# Altium schematic sheet EEPROM_SCH.SchDoc
size D
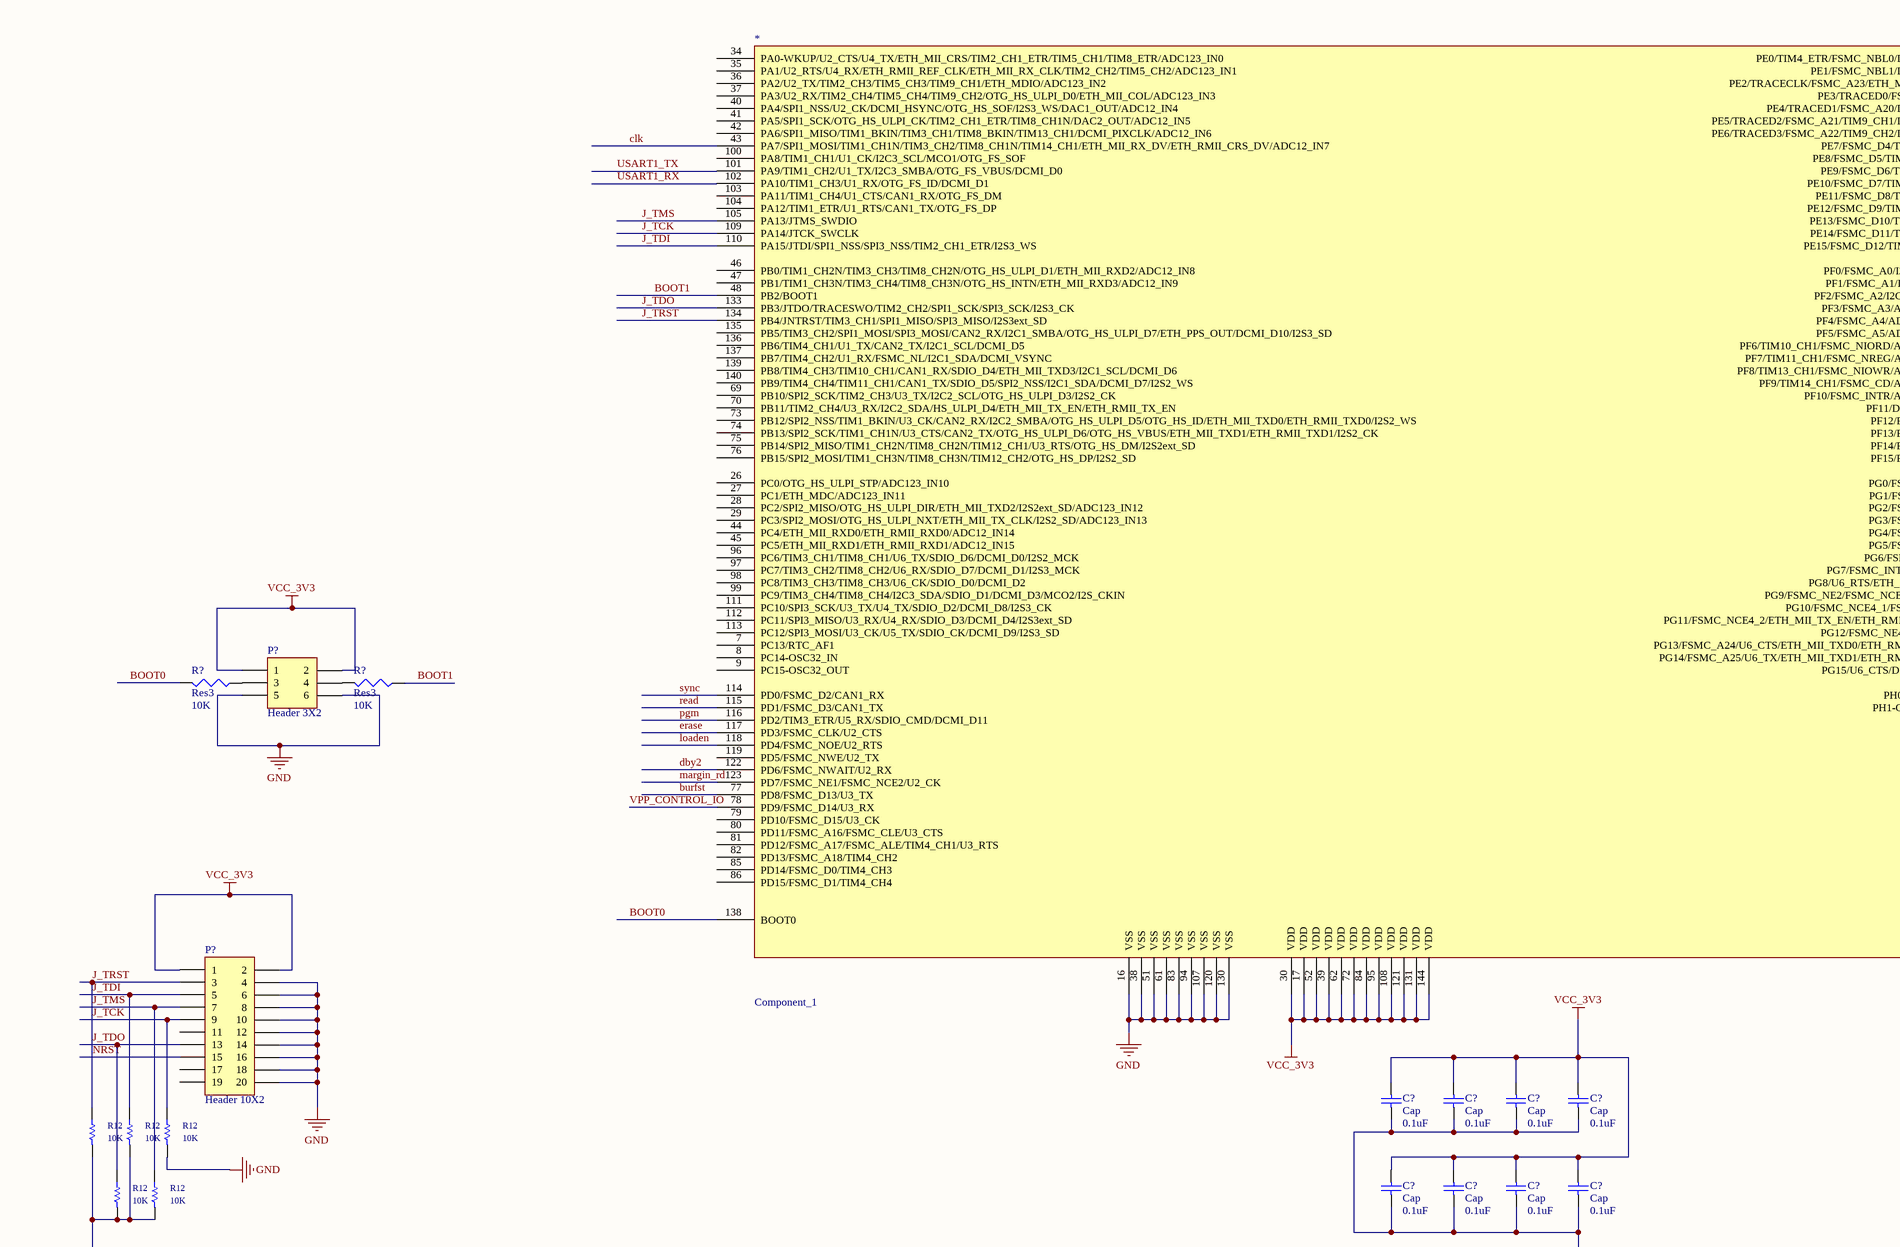
[diagram p0: EEPROM_SCH.SchDoc, top left]
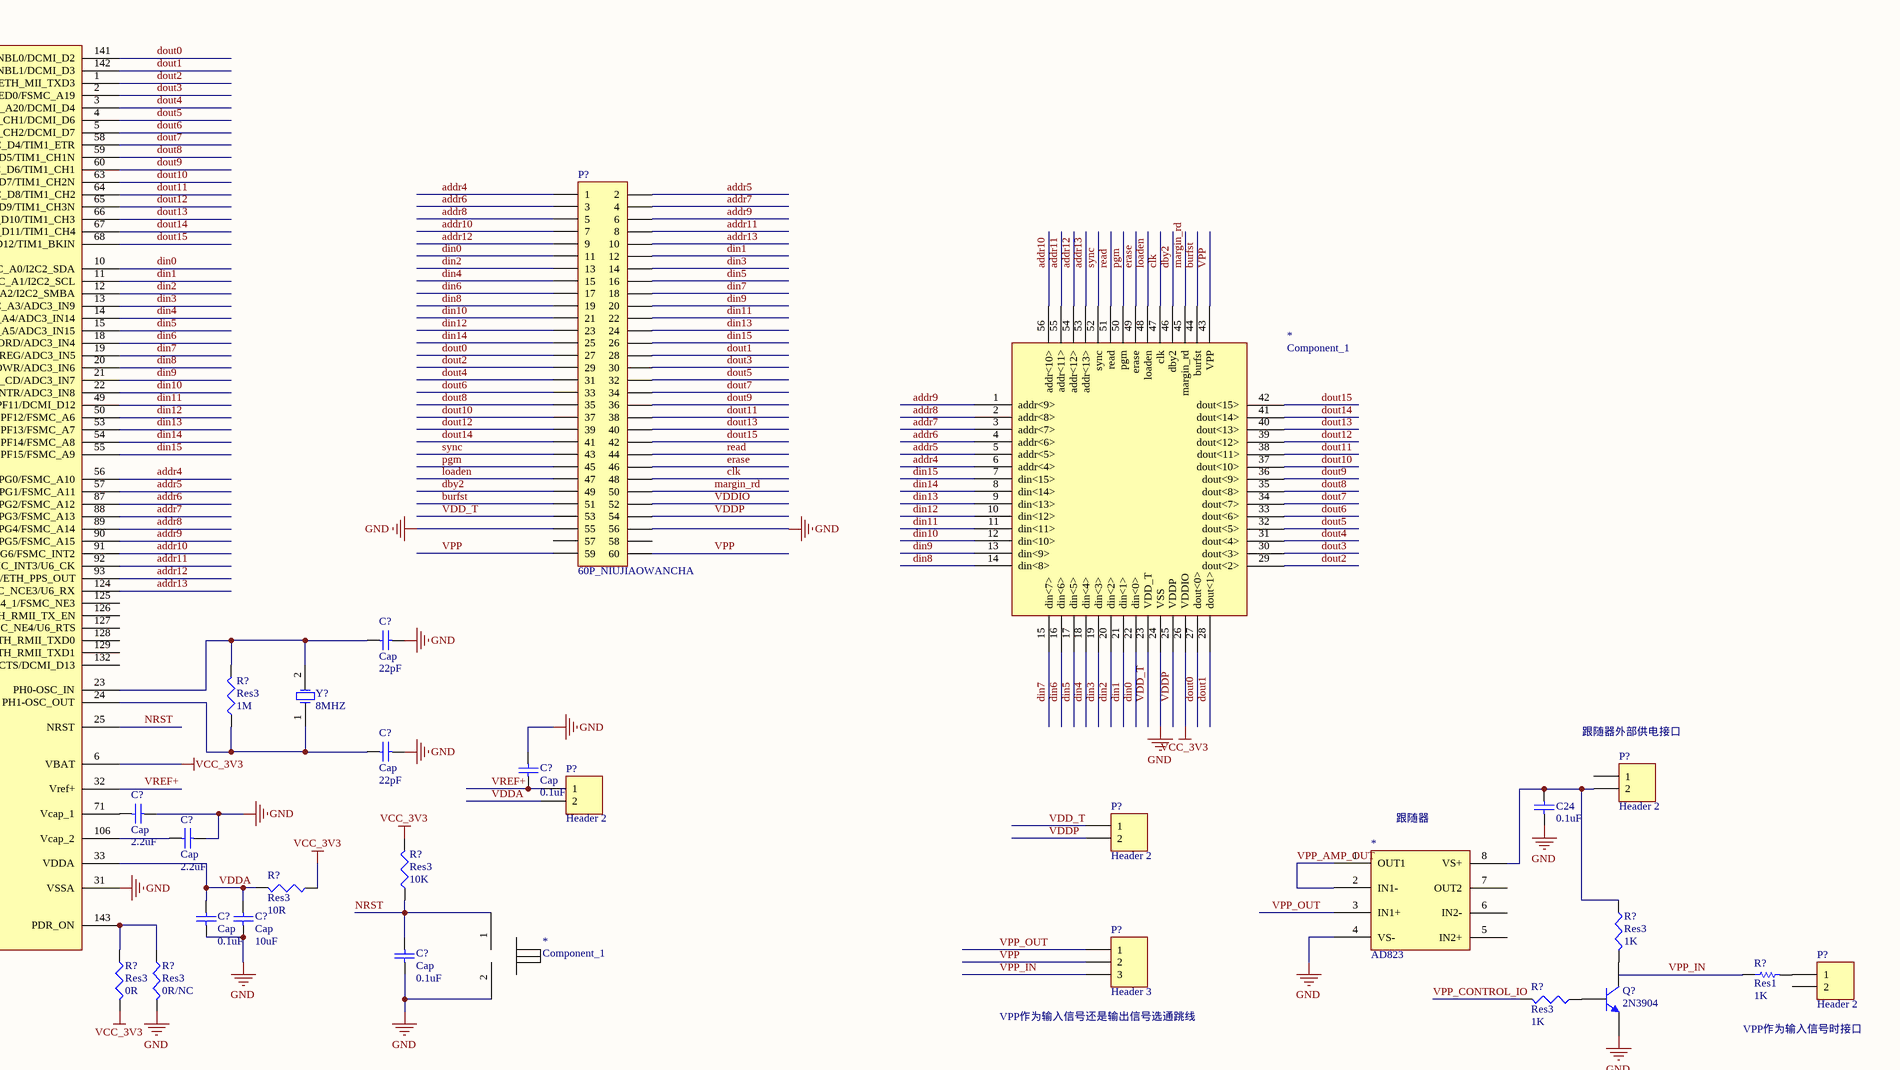
[diagram p1: EEPROM_SCH.SchDoc, top right]
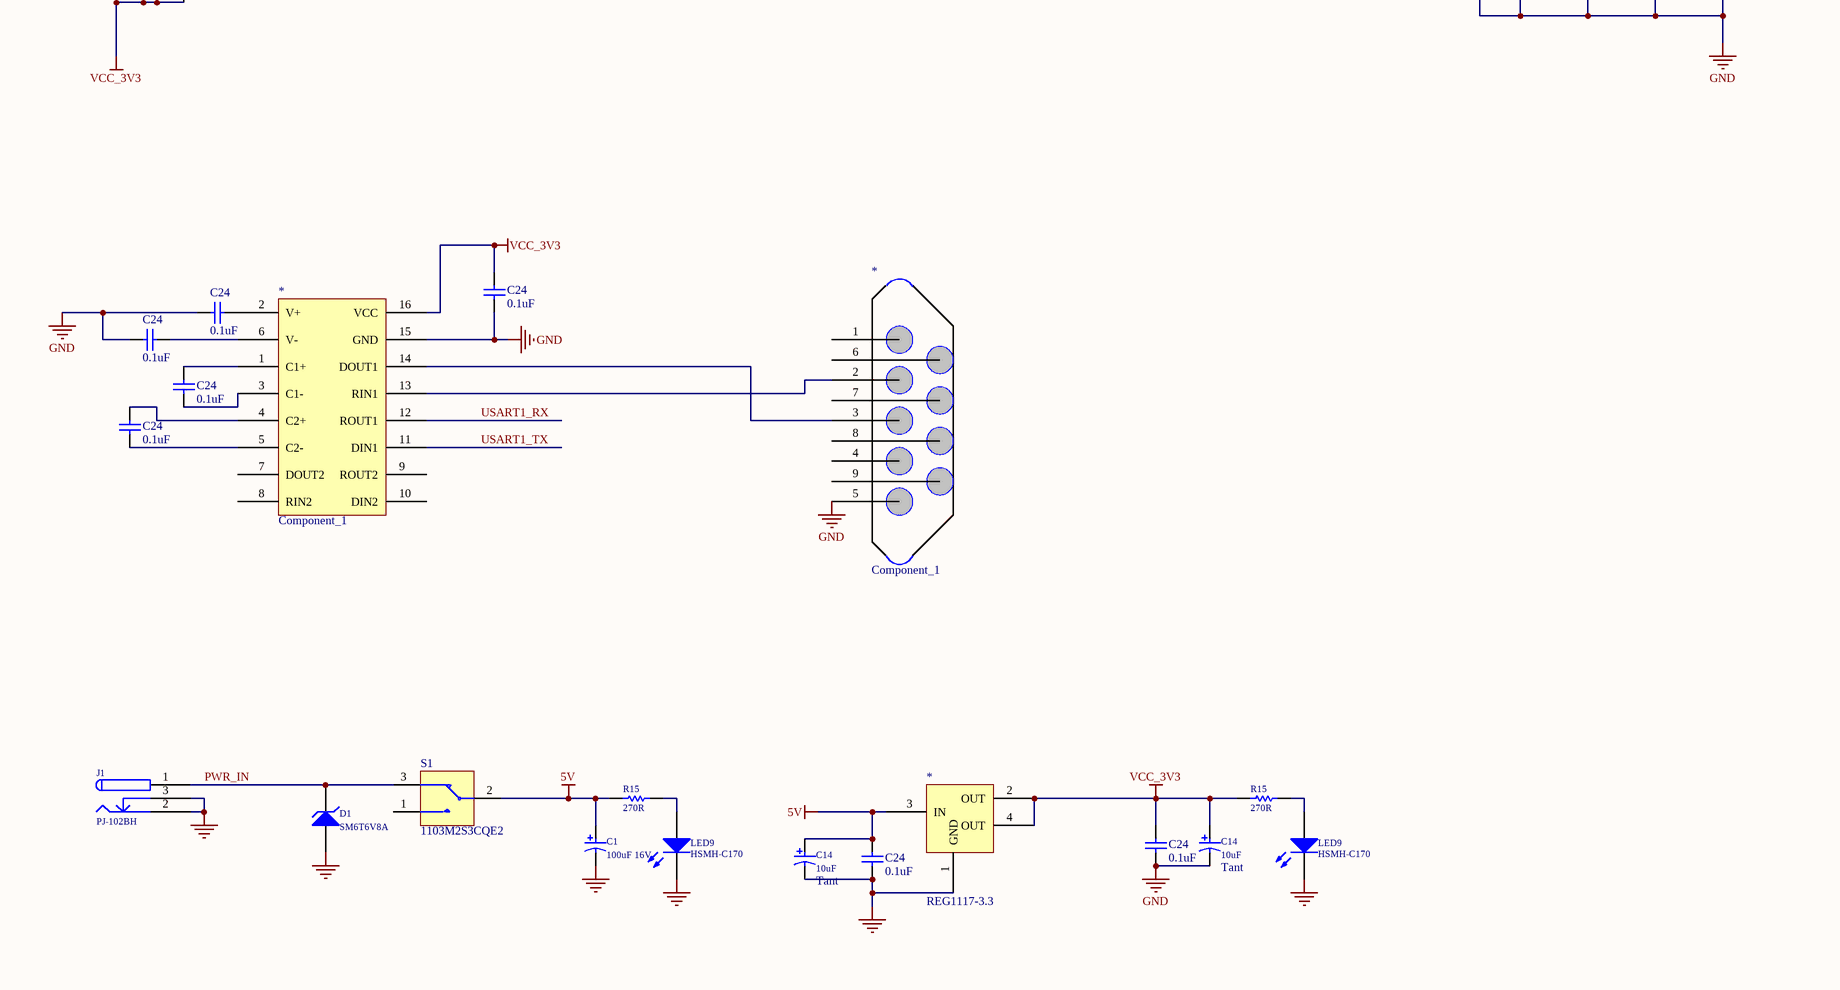
[diagram p2: EEPROM_SCH.SchDoc, bottom left]
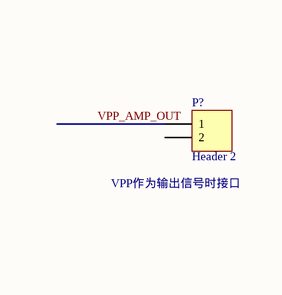
[diagram p3: EEPROM_SCH.SchDoc, bottom right]

## Parts
(Parts that share a designator on the sheet are numbered #1, #2 ... from top to bottom, then left to right.)
*#1  Component_1  [STM32F407ZGT6_LCC144]
*#2  Component_1
*#3  AD823
*#4  Component_1
*#5  Component_1
*#6  Component_1
*#7  REG1117-3.3  [PCBComponent_1]
C1  100uF 16V  [CAPPR2-5X6.8]
C14#1  10uF  Capacitor Type: Tant  [MCCT-B]
C14#2  10uF  Capacitor Type: Tant  [MCCT-B]
C24#1  0.1uF  [CC2012-0805]
C24#2  0.1uF  [CC2012-0805]
C24#3  0.1uF  [CC2012-0805]
C24#4  0.1uF  [CC2012-0805]
C24#5  0.1uF  [CC2012-0805]
C24#6  0.1uF  [CC2012-0805]
C24#7  0.1uF  [CC2012-0805]
C24#8  0.1uF  [CC2012-0805]
C?#1  Cap  value 22pF  [RAD-0.3]
C?#2  Cap  value 22pF  [RAD-0.3]
C?#3  Cap  value 0.1uF  [RAD-0.3]
C?#4  Cap  value 2.2uF  [RAD-0.3]
C?#5  Cap  value 2.2uF  [RAD-0.3]
C?#6  Cap  value 0.1uF  [RAD-0.3]
C?#7  Cap  value 10uF  [RAD-0.3]
C?#8  Cap  value 0.1uF  [RAD-0.3]
C?#9  Cap  value 0.1uF  [RAD-0.3]
C?#10  Cap  value 0.1uF  [RAD-0.3]
C?#11  Cap  value 0.1uF  [RAD-0.3]
C?#12  Cap  value 0.1uF  [RAD-0.3]
C?#13  Cap  value 0.1uF  [RAD-0.3]
C?#14  Cap  value 0.1uF  [RAD-0.3]
C?#15  Cap  value 0.1uF  [RAD-0.3]
C?#16  Cap  value 0.1uF  [RAD-0.3]
D1  SM6T6V8A  [PCBComponent_1]
J1  PJ-102BH  [PCBComponent_1]
LED9#1  HSMH-C170  [SMD _LED]
LED9#2  HSMH-C170  [SMD _LED]
P?#1  60P_NIUJIAOWANCHA  [PCBComponent_1]
P?#2  Header 3X2  [PCBComponent_1]
P?#3  Header 2  [HDR1X2]
P?#4  Header 2  [HDR1X2]
P?#5  Header 2  [HDR1X2]
P?#6  Header 3  [HDR1X3]
P?#7  Header 10X2  [HDR2X10]
P?#8  Header 2  [HDR1X2]
P?#9  Header 2  [HDR1X2]
Q?  2N3904  [TO-92A]
R12#1  10K  [CC2012-0805]
R12#2  10K  [CC2012-0805]
R12#3  10K  [CC2012-0805]
R12#4  10K  [CC2012-0805]
R12#5  10K  [CC2012-0805]
R15#1  270R  [CR2012-0805]
R15#2  270R  [CR2012-0805]
R?#1  Res3  value 10K  [J1-0603]
R?#2  Res3  value 10K  [J1-0603]
R?#3  Res3  value 1M  [J1-0603]
R?#4  Res3  value 10K  [J1-0603]
R?#5  Res3  value 10R  [J1-0603]
R?#6  Res3  value 1K  [J1-0603]
R?#7  Res3  value 0R  [J1-0603]
R?#8  Res3  value 0R/NC  [J1-0603]
R?#9  Res1  value 1K  [AXIAL-0.3]
R?#10  Res3  value 1K  [J1-0603]
S1  1103M2S3CQE2  [PCBComponent_1]
Y?  8MHZ  [R38]

## Nets
5V: *#7.3(IN) C1.1 C14#2.1 C24#8.2 R15#1.2 S1.2
GND: *#1.16(VSS) *#1.31(VSSA) *#1.38(VSS) *#1.51(VSS) *#1.61(VSS) *#1.83(VSS) *#1.94(VSS) *#1.107(VSS) *#1.120(VSS) *#1.130(VSS) *#2.24(VSS) *#3.4(VS-) *#4.2 *#5.15(GND) *#6.5 *#7.1(GND) C1.2 C14#1.2 C14#2.2 C24#1.1 C24#2.1 C24#3.1 C24#4.2 C24#7.1 C24#8.1 C?#1.1 C?#2.1 C?#3.1 C?#4.2 C?#5.2 C?#6.2 C?#7.2 C?#8.2 C?#9.1 C?#10.1 C?#11.1 C?#12.1 C?#13.1 C?#14.1 C?#15.1 C?#16.1 D1.1(A) J1.2 J1.3 LED9#1.2(K) LED9#2.2(K) P?#1.55 P?#1.56 P?#2.5 P?#2.6 P?#7.4 P?#7.6 P?#7.8 P?#7.10 P?#7.12 P?#7.14 P?#7.16 P?#7.18 P?#7.20 Q?.1(E) R12#3.2 R?#8.2
VCC_3V3: *#1.6(VBAT) *#1.17(VDD) *#1.30(VDD) *#1.39(VDD) *#1.52(VDD) *#1.62(VDD) *#1.72(VDD) *#1.84(VDD) *#1.95(VDD) *#1.108(VDD) *#1.121(VDD) *#1.131(VDD) *#1.144(VDD) *#2.26(VDDIO) *#5.16(VCC) *#7.2(OUT) *#7.4(OUT) C14#1.1 C24#3.2 C24#7.2 C?#9.2 C?#10.2 C?#11.2 C?#12.2 C?#13.2 C?#14.2 C?#15.2 C?#16.2 P?#2.1 P?#2.2 P?#7.1 P?#7.2 R12#1.2 R12#2.2 R12#4.2 R12#5.2 R15#2.2 R?#4.2 R?#5.1 R?#7.2
addr4: *#1.56(PG0/FSMC_A10) *#2.6(addr<4>) P?#1.1
addr5: *#1.57(PG1/FSMC_A11) *#2.5(addr<5>) P?#1.2
addr6: *#1.87(PG2/FSMC_A12) *#2.4(addr<6>) P?#1.3
addr7: *#1.88(PG3/FSMC_A13) *#2.3(addr<7>) P?#1.4
addr8: *#1.89(PG4/FSMC_A14) *#2.2(addr<8>) P?#1.5
addr9: *#1.90(PG5/FSMC_A15) *#2.1(addr<9>) P?#1.6
addr10: *#1.91(PG6/FSMC_INT2) *#2.56(addr<10>) P?#1.7
addr11: *#1.92(PG7/FSMC_INT3/U6_CK) *#2.55(addr<11>) P?#1.8
addr12: *#1.93(PG8/U6_RTS/ETH_PPS_OUT) *#2.54(addr<12>) P?#1.9
addr13: *#1.124(PG9/FSMC_NE2/FSMC_NCE3/U6_RX) *#2.53(addr<13>) P?#1.10
BOOT0: *#1.138(BOOT0) R?#1.2
BOOT1: *#1.48(PB2/BOOT1) R?#2.1
burfst: *#1.77(PD8/FSMC_D13/U3_TX) *#2.44(burfst) P?#1.51
clk: *#1.43(PA7/SPI1_MOSI/TIM1_CH1N/TIM3_CH2/TIM8_CH1N/TIM14_CH1/ETH_MII_RX_DV/ETH_RMII_CRS_DV/ADC12_IN7) *#2.47(clk) P?#1.48
dby2: *#1.122(PD6/FSMC_NWAIT/U2_RX) *#2.46(dby2) P?#1.49
din0: *#1.10(PF0/FSMC_A0/I2C2_SDA) *#2.22(din<0>) P?#1.11
din1: *#1.11(PF1/FSMC_A1/I2C2_SCL) *#2.21(din<1>) P?#1.12
din2: *#1.12(PF2/FSMC_A2/I2C2_SMBA) *#2.20(din<2>) P?#1.13
din3: *#1.13(PF3/FSMC_A3/ADC3_IN9) *#2.19(din<3>) P?#1.14
din4: *#1.14(PF4/FSMC_A4/ADC3_IN14) *#2.18(din<4>) P?#1.15
din5: *#1.15(PF5/FSMC_A5/ADC3_IN15) *#2.17(din<5>) P?#1.16
din6: *#1.18(PF6/TIM10_CH1/FSMC_NIORD/ADC3_IN4) *#2.16(din<6>) P?#1.17
din7: *#1.19(PF7/TIM11_CH1/FSMC_NREG/ADC3_IN5) *#2.15(din<7>) P?#1.18
din8: *#1.20(PF8/TIM13_CH1/FSMC_NIOWR/ADC3_IN6) *#2.14(din<8>) P?#1.19
din9: *#1.21(PF9/TIM14_CH1/FSMC_CD/ADC3_IN7) *#2.13(din<9>) P?#1.20
din10: *#1.22(PF10/FSMC_INTR/ADC3_IN8) *#2.12(din<10>) P?#1.21
din11: *#1.49(PF11/DCMI_D12) *#2.11(din<11>) P?#1.22
din12: *#1.50(PF12/FSMC_A6) *#2.10(din<12>) P?#1.23
din13: *#1.53(PF13/FSMC_A7) *#2.9(din<13>) P?#1.24
din14: *#1.54(PF14/FSMC_A8) *#2.8(din<14>) P?#1.25
din15: *#1.55(PF15/FSMC_A9) *#2.7(din<15>) P?#1.26
dout0: *#1.141(PE0/TIM4_ETR/FSMC_NBL0/DCMI_D2) *#2.27(dout<0>) P?#1.27
dout1: *#1.142(PE1/FSMC_NBL1/DCMI_D3) *#2.28(dout<1>) P?#1.28
dout2: *#1.1(PE2/TRACECLK/FSMC_A23/ETH_MII_TXD3) *#2.29(dout<2>) P?#1.29
dout3: *#1.2(PE3/TRACED0/FSMC_A19) *#2.30(dout<3>) P?#1.30
dout4: *#1.3(PE4/TRACED1/FSMC_A20/DCMI_D4) *#2.31(dout<4>) P?#1.31
dout5: *#1.4(PE5/TRACED2/FSMC_A21/TIM9_CH1/DCMI_D6) *#2.32(dout<5>) P?#1.32
dout6: *#1.5(PE6/TRACED3/FSMC_A22/TIM9_CH2/DCMI_D7) *#2.33(dout<6>) P?#1.33
dout7: *#1.58(PE7/FSMC_D4/TIM1_ETR) *#2.34(dout<7>) P?#1.34
dout8: *#1.59(PE8/FSMC_D5/TIM1_CH1N) *#2.35(dout<8>) P?#1.35
dout9: *#1.60(PE9/FSMC_D6/TIM1_CH1) *#2.36(dout<9>) P?#1.36
dout10: *#1.63(PE10/FSMC_D7/TIM1_CH2N) *#2.37(dout<10>) P?#1.37
dout11: *#1.64(PE11/FSMC_D8/TIM1_CH2) *#2.38(dout<11>) P?#1.38
dout12: *#1.65(PE12/FSMC_D9/TIM1_CH3N) *#2.39(dout<12>) P?#1.39
dout13: *#1.66(PE13/FSMC_D10/TIM1_CH3) *#2.40(dout<13>) P?#1.40
dout14: *#1.67(PE14/FSMC_D11/TIM1_CH4) *#2.41(dout<14>) P?#1.41
dout15: *#1.68(PE15/FSMC_D12/TIM1_BKIN) *#2.42(dout<15>) P?#1.42
erase: *#1.117(PD3/FSMC_CLK/U2_CTS) *#2.49(erase) P?#1.46
J_TCK: *#1.25(NRST) *#1.105(PA13/JTMS_SWDIO) *#1.109(PA14/JTCK_SWCLK) *#1.110(PA15/JTDI/SPI1_NSS/SPI3_NSS/TIM2_CH1_ETR/I2S3_WS) *#1.133(PB3/JTDO/TRACESWO/TIM2_CH2/SPI1_SCK/SPI3_SCK/I2S3_CK) *#1.134(PB4/JNTRST/TIM3_CH1/SPI1_MISO/SPI3_MISO/I2S3ext_SD) *#4.1 C?#8.1 P?#7.3 P?#7.5 P?#7.7 P?#7.9 P?#7.13 P?#7.15 R12#1.1 R12#2.1 R12#3.1 R12#4.1 R12#5.1 R?#4.1  [also labelled J_TDI, J_TDO, J_TMS, J_TRST, NRST]
loaden: *#1.118(PD4/FSMC_NOE/U2_RTS) *#2.48(loaden) P?#1.47
margin_rd: *#1.123(PD7/FSMC_NE1/FSMC_NCE2/U2_CK) *#2.45(margin_rd) P?#1.50
pgm: *#1.116(PD2/TIM3_ETR/U5_RX/SDIO_CMD/DCMI_D11) *#2.50(pgm) P?#1.45
PWR_IN: D1.2(K) J1.1 S1.3
read: *#1.115(PD1/FSMC_D3/CAN1_TX) *#2.51(read) P?#1.44
sync: *#1.114(PD0/FSMC_D2/CAN1_RX) *#2.52(sync) P?#1.43
USART1_RX: *#1.102(PA10/TIM1_CH3/U1_RX/OTG_FS_ID/DCMI_D1) *#5.12(ROUT1)
USART1_TX: *#1.101(PA9/TIM1_CH2/U1_TX/I2C3_SMBA/OTG_FS_VBUS/DCMI_D0) *#5.11(DIN1)
VDD_T: *#2.23(VDD_T) P?#1.53 P?#5.1
VDDA: *#1.33(VDDA) C?#6.1 C?#7.1 P?#4.2 R?#5.2
VDDIO: P?#1.52
VDDP: *#2.25(VDDP) P?#1.54 P?#5.2
VPP: *#2.43(VPP) P?#1.59 P?#1.60 P?#6.2
VPP_AMP_OUT: *#3.1(OUT1) *#3.2(IN1-) P?#9.1
VPP_CONTROL_IO: *#1.78(PD9/FSMC_D14/U3_RX) R?#10.2
VPP_IN: P?#6.3 R?#9.1
VPP_OUT: *#3.3(IN1+) P?#6.1
VREF+: *#1.32(Vref+) C?#3.2 P?#4.1
Net*#1_23: *#1.23(PH0-OSC_IN) C?#1.2 R?#3.2 Y?.2(OSC2)
Net*#1_24: *#1.24(PH1-OSC_OUT) C?#2.2 R?#3.1 Y?.1(OSC1)
Net*#1_71: *#1.71(Vcap_1) C?#4.1
Net*#1_106: *#1.106(Vcap_2) C?#5.1
Net*#1_143: *#1.143(PDR_ON) R?#7.1 R?#8.1
Net*#3_8: *#3.8(VS+) C24#1.2 P?#3.2 R?#6.1
Net*#5_1: *#5.1(C1+) C24#5.2
Net*#5_2: *#5.2(V+) C24#2.2
Net*#5_3: *#5.3(C1-) C24#5.1
Net*#5_4: *#5.4(C2+) C24#6.2
Net*#5_5: *#5.5(C2-) C24#6.1
Net*#5_6: *#5.6(V-) C24#4.1
Net*#5_13: *#5.13(RIN1) *#6.2
Net*#5_14: *#5.14(DOUT1) *#6.3
NetLED9#1_1: LED9#1.1(A) R15#1.1
NetLED9#2_1: LED9#2.1(A) R15#2.1
NetP?#2_3: P?#2.3 R?#1.1
NetP?#2_4: P?#2.4 R?#2.2
NetP?#8_1: P?#8.1 R?#9.2
NetQ?_2: Q?.2(B) R?#10.1
NetQ?_3: Q?.3(C) R?#6.2

Not connected (* = marked no-connect by the designer): *#1 7(PC13/RTC_AF1) 8(PC14-OSC32_IN) 9(PC15-OSC32_OUT) 26(PC0/OTG_HS_ULPI_STP/ADC123_IN10) 27(PC1/ETH_MDC/ADC123_IN11) 28(PC2/SPI2_MISO/OTG_HS_ULPI_DIR/ETH_MII_TXD2/I2S2ext_SD/ADC123_IN12) 29(PC3/SPI2_MOSI/OTG_HS_ULPI_NXT/ETH_MII_TX_CLK/I2S2_SD/ADC123_IN13) 34(PA0-WKUP/U2_CTS/U4_TX/ETH_MII_CRS/TIM2_CH1_ETR/TIM5_CH1/TIM8_ETR/ADC123_IN0) 35(PA1/U2_RTS/U4_RX/ETH_RMII_REF_CLK/ETH_MII_RX_CLK/TIM2_CH2/TIM5_CH2/ADC123_IN1) 36(PA2/U2_TX/TIM2_CH3/TIM5_CH3/TIM9_CH1/ETH_MDIO/ADC123_IN2) 37(PA3/U2_RX/TIM2_CH4/TIM5_CH4/TIM9_CH2/OTG_HS_ULPI_D0/ETH_MII_COL/ADC123_IN3) 40(PA4/SPI1_NSS/U2_CK/DCMI_HSYNC/OTG_HS_SOF/I2S3_WS/DAC1_OUT/ADC12_IN4) 41(PA5/SPI1_SCK/OTG_HS_ULPI_CK/TIM2_CH1_ETR/TIM8_CH1N/DAC2_OUT/ADC12_IN5) 42(PA6/SPI1_MISO/TIM1_BKIN/TIM3_CH1/TIM8_BKIN/TIM13_CH1/DCMI_PIXCLK/ADC12_IN6) 44(PC4/ETH_MII_RXD0/ETH_RMII_RXD0/ADC12_IN14) 45(PC5/ETH_MII_RXD1/ETH_RMII_RXD1/ADC12_IN15) 46(PB0/TIM1_CH2N/TIM3_CH3/TIM8_CH2N/OTG_HS_ULPI_D1/ETH_MII_RXD2/ADC12_IN8) 47(PB1/TIM1_CH3N/TIM3_CH4/TIM8_CH3N/OTG_HS_INTN/ETH_MII_RXD3/ADC12_IN9) 69(PB10/SPI2_SCK/TIM2_CH3/U3_TX/I2C2_SCL/OTG_HS_ULPI_D3/I2S2_CK) 70(PB11/TIM2_CH4/U3_RX/I2C2_SDA/HS_ULPI_D4/ETH_MII_TX_EN/ETH_RMII_TX_EN) 73(PB12/SPI2_NSS/TIM1_BKIN/U3_CK/CAN2_RX/I2C2_SMBA/OTG_HS_ULPI_D5/OTG_HS_ID/ETH_MII_TXD0/ETH_RMII_TXD0/I2S2_WS) 74(PB13/SPI2_SCK/TIM1_CH1N/U3_CTS/CAN2_TX/OTG_HS_ULPI_D6/OTG_HS_VBUS/ETH_MII_TXD1/ETH_RMII_TXD1/I2S2_CK) 75(PB14/SPI2_MISO/TIM1_CH2N/TIM8_CH2N/TIM12_CH1/U3_RTS/OTG_HS_DM/I2S2ext_SD) 76(PB15/SPI2_MOSI/TIM1_CH3N/TIM8_CH3N/TIM12_CH2/OTG_HS_DP/I2S2_SD) 79(PD10/FSMC_D15/U3_CK) 80(PD11/FSMC_A16/FSMC_CLE/U3_CTS) 81(PD12/FSMC_A17/FSMC_ALE/TIM4_CH1/U3_RTS) 82(PD13/FSMC_A18/TIM4_CH2) 85(PD14/FSMC_D0/TIM4_CH3) 86(PD15/FSMC_D1/TIM4_CH4) 96(PC6/TIM3_CH1/TIM8_CH1/U6_TX/SDIO_D6/DCMI_D0/I2S2_MCK) 97(PC7/TIM3_CH2/TIM8_CH2/U6_RX/SDIO_D7/DCMI_D1/I2S3_MCK) 98(PC8/TIM3_CH3/TIM8_CH3/U6_CK/SDIO_D0/DCMI_D2) 99(PC9/TIM3_CH4/TIM8_CH4/I2C3_SDA/SDIO_D1/DCMI_D3/MCO2/I2S_CKIN) 100(PA8/TIM1_CH1/U1_CK/I2C3_SCL/MCO1/OTG_FS_SOF) 103(PA11/TIM1_CH4/U1_CTS/CAN1_RX/OTG_FS_DM) 104(PA12/TIM1_ETR/U1_RTS/CAN1_TX/OTG_FS_DP) 111(PC10/SPI3_SCK/U3_TX/U4_TX/SDIO_D2/DCMI_D8/I2S3_CK) 112(PC11/SPI3_MISO/U3_RX/U4_RX/SDIO_D3/DCMI_D4/I2S3ext_SD) 113(PC12/SPI3_MOSI/U3_CK/U5_TX/SDIO_CK/DCMI_D9/I2S3_SD) 119(PD5/FSMC_NWE/U2_TX) 125(PG10/FSMC_NCE4_1/FSMC_NE3) 126(PG11/FSMC_NCE4_2/ETH_MII_TX_EN/ETH_RMII_TX_EN) 127(PG12/FSMC_NE4/U6_RTS) 128(PG13/FSMC_A24/U6_CTS/ETH_MII_TXD0/ETH_RMII_TXD0) 129(PG14/FSMC_A25/U6_TX/ETH_MII_TXD1/ETH_RMII_TXD1) 132(PG15/U6_CTS/DCMI_D13) 135(PB5/TIM3_CH2/SPI1_MOSI/SPI3_MOSI/CAN2_RX/I2C1_SMBA/OTG_HS_ULPI_D7/ETH_PPS_OUT/DCMI_D10/I2S3_SD) 136(PB6/TIM4_CH1/U1_TX/CAN2_TX/I2C1_SCL/DCMI_D5) 137(PB7/TIM4_CH2/U1_RX/FSMC_NL/I2C1_SDA/DCMI_VSYNC) 139(PB8/TIM4_CH3/TIM10_CH1/CAN1_RX/SDIO_D4/ETH_MII_TXD3/I2C1_SCL/DCMI_D6) 140(PB9/TIM4_CH4/TIM11_CH1/CAN1_TX/SDIO_D5/SPI2_NSS/I2C1_SDA/DCMI_D7/I2S2_WS); *#3 5(IN2+) 6(IN2-) 7(OUT2); *#5 7(DOUT2) 8(RIN2) 9(ROUT2) 10(DIN2); *#6 1 4 6 7 8 9; P?#1 57 58; P?#3 1; P?#7 11 17 19; P?#8 2; P?#9 2; S1 1

## Notes on the sheet
- (near P?#3) 跟随器外部供电接口
- (near *#3) 跟随器
- (near P?#6) VPP作为输入信号还是输出信号选通跳线
- VPP作为输入信号时接口
- (near P?#9) VPP作为输出信号时接口

## Library data of the parts
*#3 *#7 = Component_1
C1 = CAP_POLAR_1: Polar Capacitor
C14#1 C14#2 = CAP_POLAR: Polar Capacitor; AEMS Code: 2100110; Supplier: FARNELL; Supplier Code: 967-117
C24#1-C24#8 = CAP: Capacitor; Supplier: FARNELL; Supplier Code: 317-287
C?#1-C?#16 = Cap: Capacitor; Published: 8-Jun-2000; LatestRevisionDate: 17-Jul-2002; LatestRevisionNote: Re-released for DXP Platform.; PackageReference: RAD-0.3; Publisher: Altium Limited; PackageDescription: Radial Cap, Thru-Hole; 2 Leads; 0.3 in Pin Spacing
D1 = BZG03C13: Zener Diode, 6.2V, 5W; Manufacturer: Microsemi; Revision: 31-Oct-2003
J1 = KLD-0202-B: Low Voltage Power Supply Connector; Manufacturer: Kycon; AEMS Code: 3510211
LED9#1 LED9#2 = HSMX-C670: Typical RED GaAs SMD LED Agilent make; AEMS Code: 2610081; Revision: July-2002: Re-released for DXP Platform.
P?#1 = Header 30X2: Header, 30-Pin, Dual row; LatestRevisionDate: 17-Jul-2002; LatestRevisionNote: Re-released for DXP Platform.; Publisher: Altium Limited
P?#2 = Header 3X2: Header, 3-Pin, Dual row; LatestRevisionDate: 17-Jul-2002; LatestRevisionNote: Re-released for DXP Platform.; Publisher: Altium Limited
P?#3-P?#5 P?#8 P?#9 = Header 2: Header, 2-Pin; LatestRevisionDate: 17-Jul-2002; LatestRevisionNote: Re-released for DXP Platform.; Publisher: Altium Limited
P?#6 = Header 3: Header, 3-Pin; LatestRevisionDate: 17-Jul-2002; LatestRevisionNote: Re-released for DXP Platform.; Publisher: Altium Limited
P?#7 = Header 10X2: Header, 10-Pin, Dual row; LatestRevisionDate: 17-Jul-2002; LatestRevisionNote: Re-released for DXP Platform.; Publisher: Altium Limited
Q? = 2N3904: NPN General Purpose Amplifier; Published: 8-Jun-2000; LatestRevisionDate: 15-Jan-2003; LatestRevisionNote: PCB Footprint 'BCY-W3/D4.7' replaced; DatasheetVersion: 1997; PackageVersion: Sep-1998; PackageReference: TO-92A; Publisher: Altium Limited; PackageDescription: TO, Flat Index; 3 In-Line, Axial Leads; Body Dia. 4.5mm; Leads 0.51 x 0.48 mm (max); ComponentLink1Description: Manufacturer Link; ComponentLink1URL: http://www.fairchildsemi.com/; ComponentLink2Description: Datasheet; ComponentLink2URL: http://www.fairchildsemi.com/ds/2N%2F2N3904.pdf
R12#1-R12#5 = RES: Resistor; AEMS Code: 1200012JT
R15#1 R15#2 = RES: Resistor; AEMS Code: 1200430
R?#1-R?#8 R?#10 = Res3: Resistor; Published: 8-Jun-2000; LatestRevisionDate: 29-May-2009; LatestRevisionNote: IPC-7351 Footprint Added.; PackageReference: J1-0603; Publisher: Altium Limited; PackageDescription: Chip Resistor
R?#9 = Res1: Resistor; Published: 8-Jun-2000; LatestRevisionDate: 17-Jul-2002; LatestRevisionNote: Re-released for DXP Platform.; PackageReference: AXIAL-0.3; Publisher: Altium Limited; PackageDescription: Axial Device, Thru-Hole; 2 Leads; 0.3 in Pin Spacing
S1 = PCB_MOUNT_SWITCH: SPDT Subminiature Toggle Switch; Supplier: FARNELL; Supplier Code: 150-559
Y? = XTAL: Crystal Oscillator; Published: 8-Jun-2000; LatestRevisionDate: 17-Jul-2002; LatestRevisionNote: Re-released for DXP Platform.; PackageReference: R38; Publisher: Altium Limited; PackageDescription: Crystal, Thru-Hole; 2 Leads; Body 3.1 x 8.2 mm (Dia.xH)